# Altium schematic sheet Cover Page.SchDoc: [1] Cover Page
size A3; ApprovedBy: Nagy Richard; CheckedBy: Nagy Richard; Author: Nagy Richard; CompanyName: EmbedCore; DrawnBy: Nagy Richard; Engineer: Nagy Richard; Organization: EmbedCore; Revision: 1.0; SheetNumber: 1; SheetTotal: 15
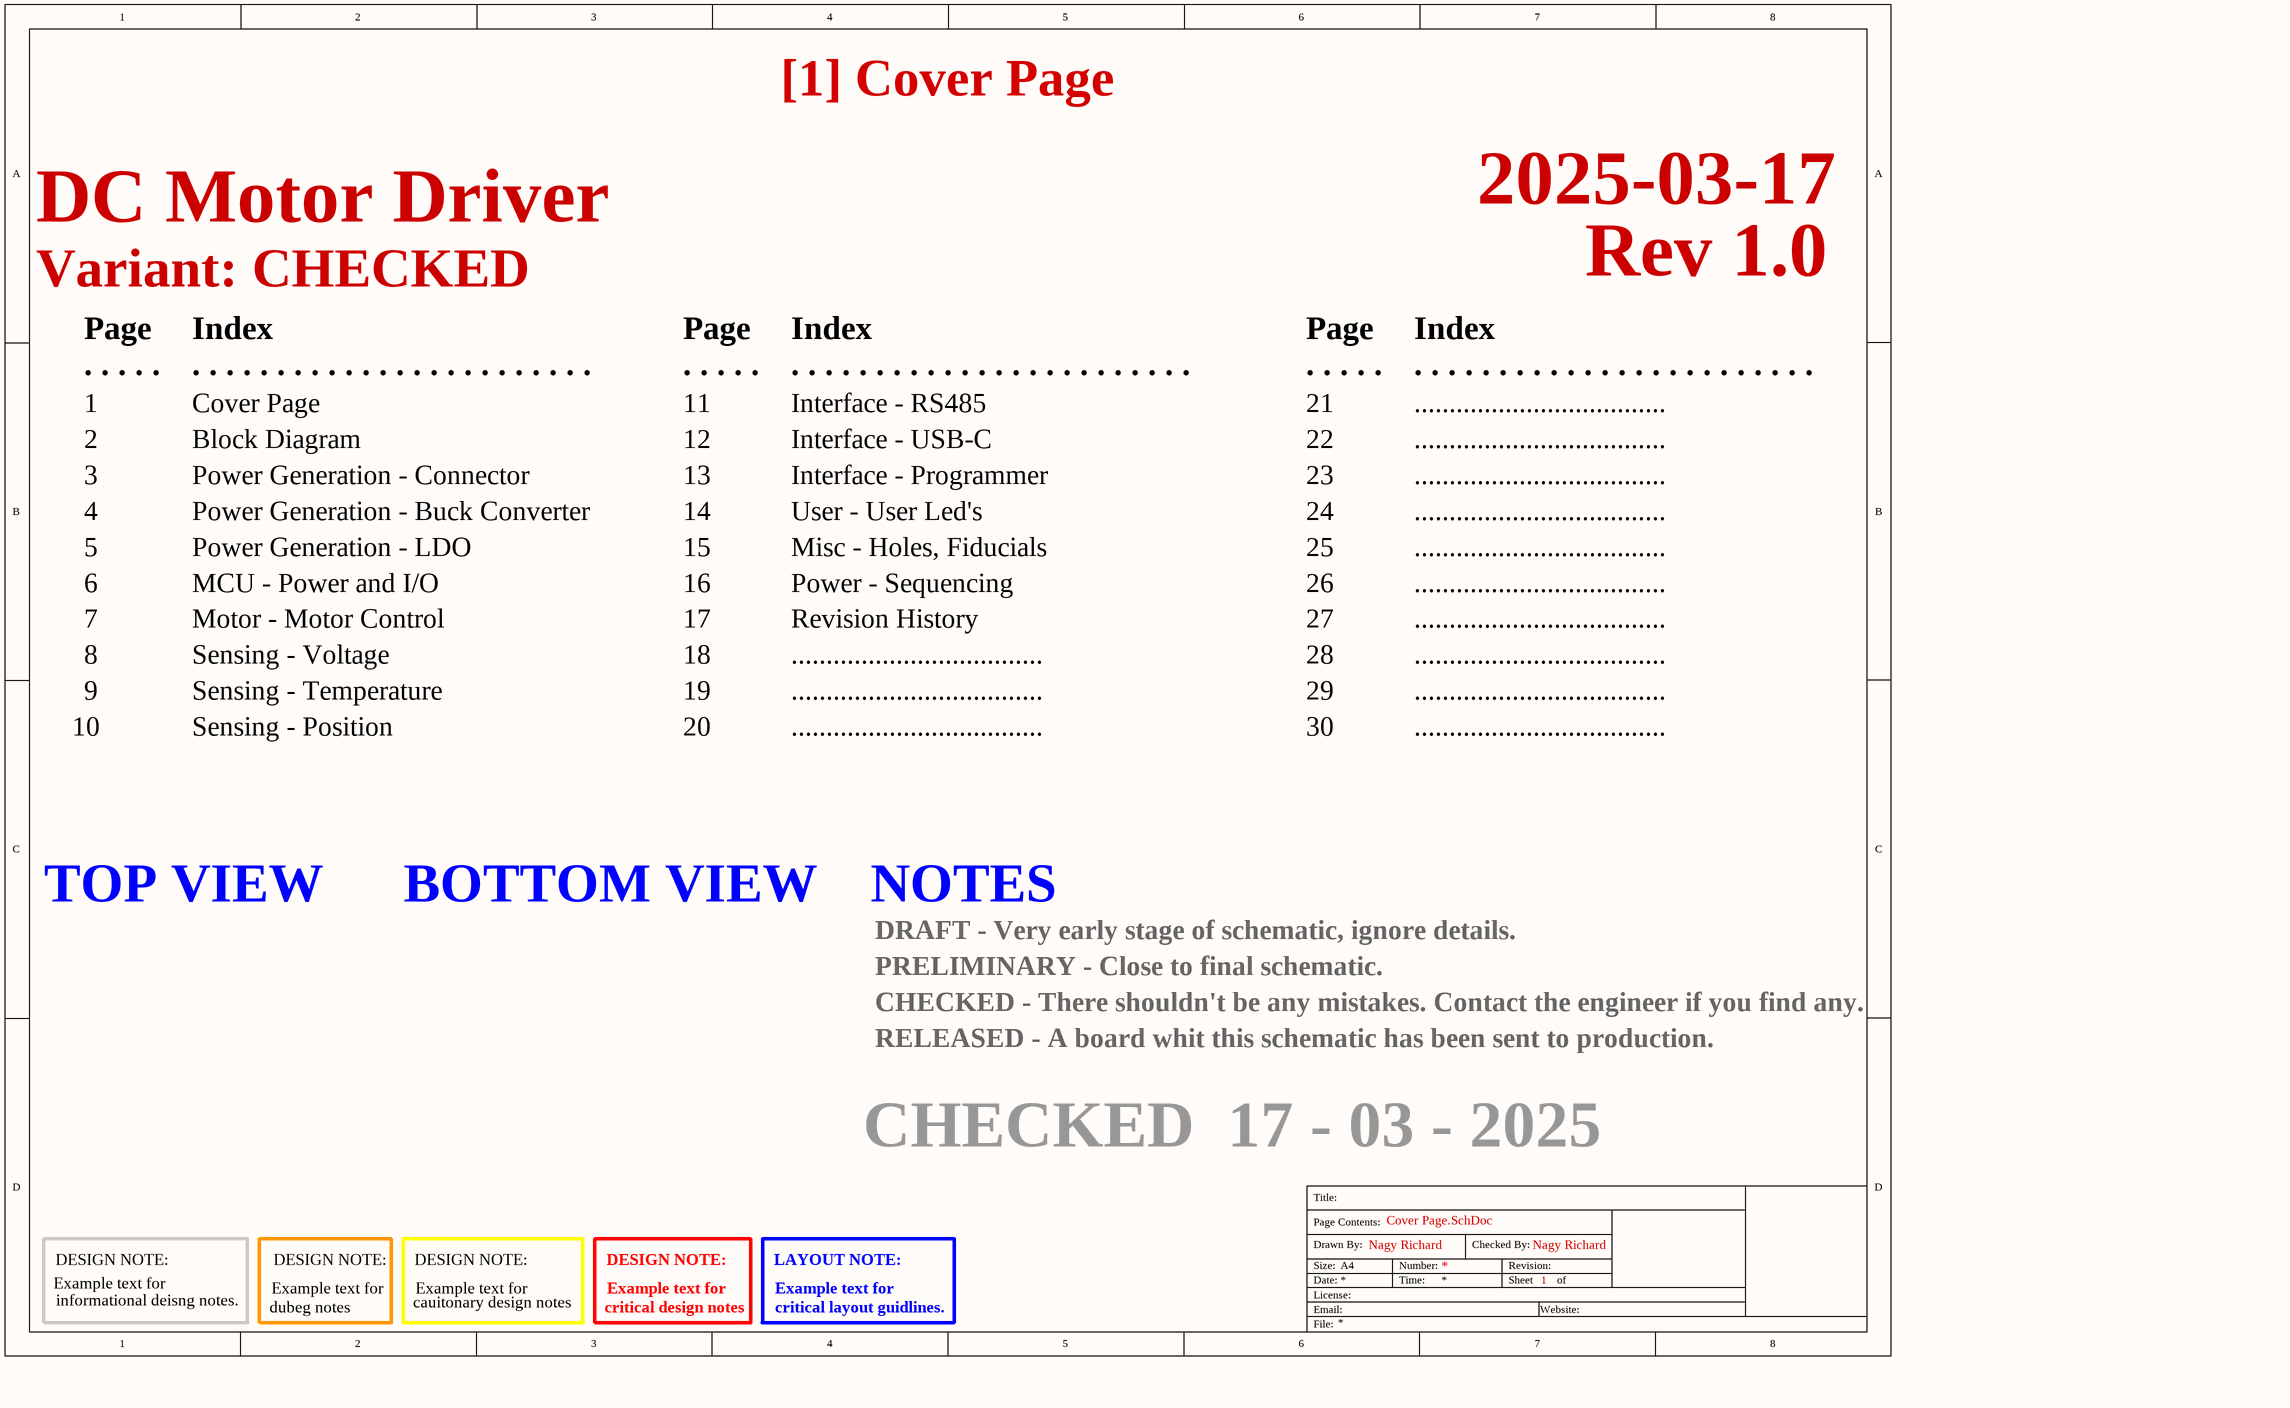
[diagram p0: Cover Page.SchDoc]

## Notes on the sheet
- 2025-03-17
- DC Motor Driver
- Variant: CHECKED
- Page
- Index
- Rev 1.0
- . . . . .
- . . . . . . . . . . . . . . . . . . . . . . . .
- 1
- 2
- Cover Page
- Block Diagram
- 11
- 12
- Interface - RS485
- Interface - USB-C
- 21
- 22
- ....................................
- 3
- 4
- Power Generation - Connector
- Power Generation - Buck Converter
- 13
- 14
- Interface - Programmer
- User - User Led's
- 23
- 24
- 5
- Power Generation - LDO
- 15
- Misc - Holes, Fiducials
- 25
- 6
- 7
- MCU - Power and I/O
- Motor - Motor Control
- 16
- 17
- Power - Sequencing
- Revision History
- 26
- 27
- 8
- 9
- Sensing - Voltage
- Sensing - Temperature
- 18
- 19
- 28
- 29
- 10
- Sensing - Position
- 20
- 30
- TOP VIEW
- BOTTOM VIEW
- NOTES
- DRAFT - Very early stage of schematic, ignore details.
- CHECKED - There shouldn't be any mistakes. Contact the engineer if you find any.
- PRELIMINARY - Close to final schematic.
- RELEASED - A board whit this schematic has been sent to production.
- CHECKED  17 - 03 - 2025
- Example text for
- DESIGN NOTE:
- informational deisng notes.
- dubeg notes
- cauitonary design notes
- critical design notes
- LAYOUT NOTE:
- critical layout guidlines.
- Title:
- Drawn By:
- Page Contents:
- Checked By:
- Size:
- Date:
- File:
- License:
- Email:
- A4
- Number:
- Time:
- Revision:
- Sheet
- Website:
- of